# EAGLE design Lamp Logic Board_4 (EAGLE 9.4.2)

## Sheet 1 of 4
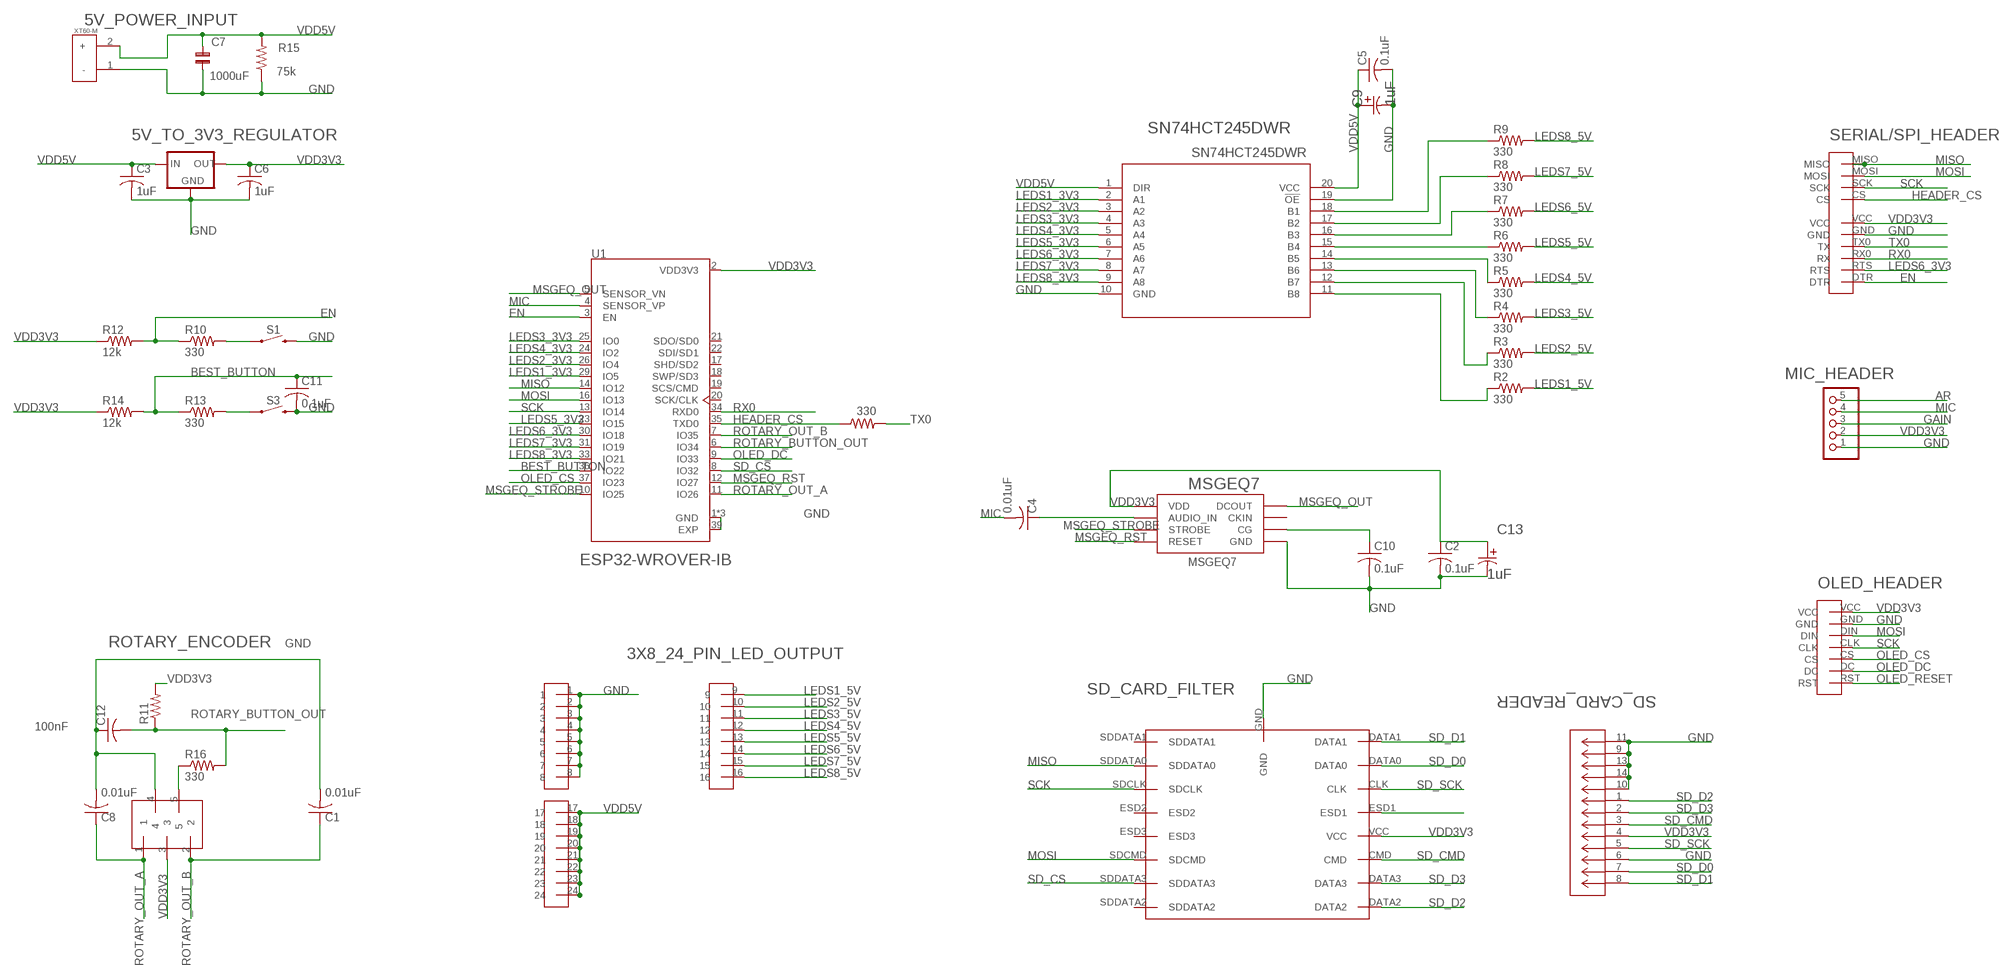
[diagram p0: schematic, sheet 1]

### Parts
3X8_24_PIN_LED_OUTPUT  3X8PINHEAD  [3X8PINHEAD]
5V_POWER_INPUT  XT60-M  [AMASS_XT60-M]
5V_TO_3V3_REGULATOR  LM1117MP-1.8  [SOT223]
C1  0.01uF  C-USC0402  [C0402]
C2  0.1uF  C-USC0805  [C0805]
C3  1uF  C-USC0402  [C0402]
C4  0.01uF  C-USC0402  [C0402]
C5  0.1uF  C-USC0805  [C0805]
C6  1uF  C-USC0402  [C0402]
C7  1000uF  C-BP-2,0X5  [ENP2,0-5]
C8  0.01uF  C-USC0402  [C0402]
C9  1uF  EEEFC1V1R0R  [CAP_EEFC_B]
C10  0.1uF  C-USC0805  [C0805]
C11  0.1uF  C-USC0805  [C0805]
C12  100nF  C-USC0402  [C0402]
C13  1uF  EEEFC1V1R0R  [CAP_EEFC_B]
MIC_HEADER  PINHD-1X5  [1X05]
MSGEQ7  MSGEQ7DIL  [DIL-08]
OLED_HEADER  SPIOLED_STANDOFF  [SPIOLED_STADOFF]
R1  330  R-US_R1206  [R1206]
R2  330  R-US_R1206  [R1206]
R3  330  R-US_R1206  [R1206]
R4  330  R-US_R1206  [R1206]
R5  330  R-US_R1206  [R1206]
R6  330  R-US_R1206  [R1206]
R7  330  R-US_R1206  [R1206]
R8  330  R-US_R1206  [R1206]
R9  330  R-US_R1206  [R1206]
R10  330  R-US_R1206  [R1206]
R11  R-US_R0603  [R0603]
R12  12k  R-US_R0603  [R0603]
R13  330  R-US_R1206  [R1206]
R14  12k  R-US_R0603  [R0603]
R15  75k  R-US_0309/12  [0309/12]
R16  330  R-US_R1206  [R1206]
ROTARY_ENCODER  EN11-HSM1AF15  [EN11-HSM]
S1  MOMENTARY-SWITCH-SPST-SMD-6.0X3.5MM  [TACTILE_SWITCH_SMD_6.0X3.5MM]
S3  MOMENTARY-SWITCH-SPST-SMD-12MM  [TACTILE_SWITCH_SMD_12MM]
SD_CARD_FILTER  CM1624-08DE  [CM1624-08DE]
SD_CARD_READER  LLC  [CON00218_8]
SERIAL/SPI_HEADER  2X6PINHEAD  [2X6PINHEAD]
SN74HCT245DWR  SN74HCT245DWR  [DW20]
U1  ESP32-WROVER-IB  ESP32-WROVER-I  [XCVR_ESP32-WROVER-I]

### Nets
AR: MIC_HEADER.5
BEST_BUTTON: C11.1 R13.1 R14.2 U1.36(IO22)
EN: R10.1 R12.2 SERIAL/SPI_HEADER.DTR U1.3(EN)
GAIN: MIC_HEADER.3
GND: 3X8_24_PIN_LED_OUTPUT.1 3X8_24_PIN_LED_OUTPUT.2 3X8_24_PIN_LED_OUTPUT.3 3X8_24_PIN_LED_OUTPUT.4 3X8_24_PIN_LED_OUTPUT.5 3X8_24_PIN_LED_OUTPUT.6 3X8_24_PIN_LED_OUTPUT.7 3X8_24_PIN_LED_OUTPUT.8 5V_POWER_INPUT.1(-) 5V_TO_3V3_REGULATOR.1(GND) C1.2 C2.2 C3.2 C5.2 C6.2 C7.1 C8.2 C9.2 C10.2 C11.2 C12.1 C13.2 MIC_HEADER.1 MSGEQ7.2(GND) OLED_HEADER.GND R15.1 ROTARY_ENCODER.4 S1.2 S3.3 SD_CARD_FILTER.GND SD_CARD_READER.6 SD_CARD_READER.9 SD_CARD_READER.10 SD_CARD_READER.11 SD_CARD_READER.13 SD_CARD_READER.14 SERIAL/SPI_HEADER.GND SN74HCT245DWR.10(GND) SN74HCT245DWR.19(!OE) U1.1(GND) U1.15(GND) U1.38(GND) U1.39(EXP)
HEADER_CS: R1.1 SERIAL/SPI_HEADER.CS U1.35(TXD0)
LEDS1_3V3: SN74HCT245DWR.2(A1) U1.29(IO5)
LEDS1_5V: 3X8_24_PIN_LED_OUTPUT.9 R2.2
LEDS2_3V3: SN74HCT245DWR.3(A2) U1.26(IO4)
LEDS2_5V: 3X8_24_PIN_LED_OUTPUT.10 R3.2
LEDS3_3V3: SN74HCT245DWR.4(A3) U1.25(IO0)
LEDS3_5V: 3X8_24_PIN_LED_OUTPUT.11 R4.2
LEDS4_3V3: SN74HCT245DWR.5(A4) U1.24(IO2)
LEDS4_5V: 3X8_24_PIN_LED_OUTPUT.12 R5.2
LEDS5_3V3: SN74HCT245DWR.6(A5) U1.23(IO15)
LEDS5_5V: 3X8_24_PIN_LED_OUTPUT.13 R6.2
LEDS6_3V3: SERIAL/SPI_HEADER.RTS SN74HCT245DWR.7(A6) U1.30(IO18)
LEDS6_5V: 3X8_24_PIN_LED_OUTPUT.14 R7.2
LEDS7_3V3: SN74HCT245DWR.8(A7) U1.31(IO19)
LEDS7_5V: 3X8_24_PIN_LED_OUTPUT.15 R8.2
LEDS8_3V3: SN74HCT245DWR.9(A8) U1.33(IO21)
LEDS8_5V: 3X8_24_PIN_LED_OUTPUT.16 R9.2
MIC: C4.2 MIC_HEADER.4 U1.4(SENSOR_VP)
MISO: SD_CARD_FILTER.SDDATA0 SERIAL/SPI_HEADER.MISO U1.14(IO12)
MOSI: OLED_HEADER.DIN SD_CARD_FILTER.SDCMD SERIAL/SPI_HEADER.MOSI U1.16(IO13)
MSGEQ_OUT: MSGEQ7.3(DCOUT) U1.5(SENSOR_VN)
MSGEQ_RST: MSGEQ7.7(RESET) U1.12(IO27)
MSGEQ_STROBE: MSGEQ7.4(STROBE) U1.10(IO25)
N$1: R9.1 SN74HCT245DWR.18(B1)
N$3: C4.1 MSGEQ7.5(AUDIO_IN)
N$4: C10.1 MSGEQ7.6(CG)
N$5: R16.1 ROTARY_ENCODER.5
N$6: R8.1 SN74HCT245DWR.17(B2)
N$7: R13.2 S3.1
N$8: SD_CARD_FILTER.ESD1
N$9: R10.2 S1.1
N$10: R7.1 SN74HCT245DWR.16(B3)
N$11: R6.1 SN74HCT245DWR.15(B4)
N$12: R5.1 SN74HCT245DWR.14(B5)
N$13: R4.1 SN74HCT245DWR.13(B6)
N$14: R3.1 SN74HCT245DWR.12(B7)
N$15: R2.1 SN74HCT245DWR.11(B8)
OLED_CS: OLED_HEADER.CS U1.37(IO23)
OLED_DC: OLED_HEADER.DC U1.9(IO33)
OLED_RESET: OLED_HEADER.RST
ROTARY_BUTTON_OUT: C12.2 R11.1 R16.2 U1.6(IO34)
ROTARY_OUT_A: C8.1 ROTARY_ENCODER.1 U1.11(IO26)
ROTARY_OUT_B: C1.1 ROTARY_ENCODER.2 U1.7(IO35)
RX0: SERIAL/SPI_HEADER.RX0(RX) U1.34(RXD0)
SCK: OLED_HEADER.CLK SD_CARD_FILTER.SDCLK SERIAL/SPI_HEADER.SCK U1.13(IO14)
SD_CMD: SD_CARD_FILTER.CMD SD_CARD_READER.3
SD_CS: SD_CARD_FILTER.SDDATA3 U1.8(IO32)
SD_D0: SD_CARD_FILTER.DATA0 SD_CARD_READER.7
SD_D1: SD_CARD_FILTER.DATA1 SD_CARD_READER.8
SD_D2: SD_CARD_FILTER.DATA2 SD_CARD_READER.1
SD_D3: SD_CARD_FILTER.DATA3 SD_CARD_READER.2
SD_SCK: SD_CARD_FILTER.CLK SD_CARD_READER.5
TX0: R1.2 SERIAL/SPI_HEADER.TX0(TX)
VDD3V3: 5V_TO_3V3_REGULATOR.2(OUT) 5V_TO_3V3_REGULATOR.4(OUT) C2.1 C6.1 C13.1 MIC_HEADER.2 MSGEQ7.1(VDD) OLED_HEADER.VCC R11.2 R12.1 R14.1 ROTARY_ENCODER.3 SD_CARD_FILTER.VCC SD_CARD_READER.4 SERIAL/SPI_HEADER.VCC U1.2(VDD3V3)
VDD5V: 3X8_24_PIN_LED_OUTPUT.17 3X8_24_PIN_LED_OUTPUT.18 3X8_24_PIN_LED_OUTPUT.19 3X8_24_PIN_LED_OUTPUT.20 3X8_24_PIN_LED_OUTPUT.21 3X8_24_PIN_LED_OUTPUT.22 3X8_24_PIN_LED_OUTPUT.23 3X8_24_PIN_LED_OUTPUT.24 5V_POWER_INPUT.2(+) 5V_TO_3V3_REGULATOR.3(IN) C3.1 C5.1 C7.2 C9.1 R15.2 SN74HCT245DWR.1(DIR) SN74HCT245DWR.20(VCC)
Unconnected: MSGEQ7.8(CKIN) SD_CARD_FILTER.ESD2 SD_CARD_FILTER.ESD3 SD_CARD_FILTER.SDDATA1 SD_CARD_FILTER.SDDATA2 U1.17(SHD/SD2) U1.18(SWP/SD3) U1.19(SCS/CMD) U1.20(SCK/CLK) U1.21(SDO/SD0) U1.22(SDI/SD1)

## Sheet 2 of 4

## Sheet 3 of 4

## Sheet 4 of 4

## Library data of the parts
3X8_24_PIN_LED_OUTPUT = 3X8PINHEAD:3X8PINHEAD
5V_POWER_INPUT = XT60-M:XT60-M: DC supply; XT60; male; PIN:2; for cable; soldered; 60A; 500V; AVAILABILITY: Unavailable; MF: AMASS; MP: XT60-M; PACKAGE: Package Analog Devices; PRICE: None
5V_TO_3V3_REGULATOR = lm1117:LM1117?-*: 800mA Low-Dropout Linear Regulator Source: http://ww1.microchip.com/downloads/en/DeviceDoc/39760d.pdf; MF: Texas Instruments; MPN: LM1117MP-1.8; OC_FARNELL: 1469053; OC_NEWARK: 41K3467
C1-C6 C8 C10-C12 = resistor:C-US: CAPACITOR, American symbol
C7 = cap-pan40:C-BP: BIPOLAR ELECTROLYTIC
C9 C13 = EEE-FC1V1R0R:EEEFC1V1R0R; MANUFACTURER_PART_NUMBER: EEEFC1V1R0R; VENDOR: Panasonic
MIC_HEADER = pinhead:PINHD-1X5: PIN HEADER
MSGEQ7 = MSGEQ7:MSGEQ7: 7-band graphic equalizer; DESCRIPTION: Seven Band Graphic Equalizer Display Filter; DIGI-KEY_PART_NUMBER: 1568-1544-ND; DIGI-KEY_PURCHASE_URL: https://www.digikey.com/product-detail/en/sparkfun-electronics/DEV-13116/1568-1544-ND/5764478?utm_source=snapeda&utm_medium=aggregator&utm_campaign=symbol; MF: SparkFun Electronics; MP: MSGEQ7; PACKAGE: SOIC-8 Mixed Signal Integration
OLED_HEADER = SPIOLED-STANDOFF:SPIOLED_STANDOFF
R1-R16 = resistor:R-US_: RESISTOR, American symbol
ROTARY_ENCODER = untitled:EN11-HSM1AF15
S1 = SparkFun-Switches:MOMENTARY-SWITCH-SPST: Momentary Switch (Pushbutton) - SPST Normally-open (NO) SPST momentary switches (buttons, pushbuttons). Variants PTH-12MM - 12mm square, through-hole Momentary Pushbutton Switch - 12mm Square <https://www.sparkfun.com/products/9190> (COM-09190) PTH-6.0MM, PTH-6.0MM-KIT - 6.0mm square, through-hole Mini Pushbutton Switch <https://www.sparkfun.com/products/97> (COM-00097) KIT package intended for soldering kit's - only one side of pads' copper is exposed. PTH-RIGHT-ANGLE-KIT - Right-angle, through-hole Right Angle Tactile Button <https://www.sparkfun.com/products/10791> - Used on SparkFun BigTime Watch Kit <https://www.sparkfun.com/products/11734> SMD-12MM - 12mm square, surface-mount Tactile Button - SMD (12mm) <https://www.sparkfun.com/products/12993> (COM-12993) Used on SparkFun PicoBoard <https://www.sparkfun.com/products/11888> SMD-4.5MM - 4.5mm Square Trackball Switch Used on SparkFun Blackberry Trackballer Breakout <https://www.sparkfun.com/products/13169> SMD-4.6MMX2.8MM - 4.60mm x 2.80mm, surface mount Used on SparkFun SAMD21 Mini Breakout <https://www.sparkfun.com/products/13664> SMD-5.2MM, SMD-5.2-REDUNDANT - 5.2mm square, surface-mount Mini Pushbutton Switch - SMD <https://www.sparkfun.com/products/8720> (COM-08720) Used on Arduino Pro Mini <https://www.sparkfun.com/products/11114> REDUNDANT package connects both switch circuits together SMD-6.0X3.5MM - 6.0 x 3.5mm, surface mount Momentary Reset Switch SMD <https://www.sparkfun.com/products/8229> (COM-08229) SMD-6.2MM-TALL - 6.2mm square, surface mount Tactile Button - SMD (6mm) <https://www.sparkfun.com/products/12992> Used on SparkFun Digital Sandbox <https://www.sparkfun.com/products/12651> SMD-RIGHT-ANGLE - Right-angle, surface mount Used on SparkFun Block for Intel® Edison - Arduino <https://www.sparkfun.com/products/13036>; PROD_ID: SWCH-00815; SF_SKU: COM-08229
S3 = SparkFun-Switches:MOMENTARY-SWITCH-SPST: Momentary Switch (Pushbutton) - SPST Normally-open (NO) SPST momentary switches (buttons, pushbuttons). Variants PTH-12MM - 12mm square, through-hole Momentary Pushbutton Switch - 12mm Square <https://www.sparkfun.com/products/9190> (COM-09190) PTH-6.0MM, PTH-6.0MM-KIT - 6.0mm square, through-hole Mini Pushbutton Switch <https://www.sparkfun.com/products/97> (COM-00097) KIT package intended for soldering kit's - only one side of pads' copper is exposed. PTH-RIGHT-ANGLE-KIT - Right-angle, through-hole Right Angle Tactile Button <https://www.sparkfun.com/products/10791> - Used on SparkFun BigTime Watch Kit <https://www.sparkfun.com/products/11734> SMD-12MM - 12mm square, surface-mount Tactile Button - SMD (12mm) <https://www.sparkfun.com/products/12993> (COM-12993) Used on SparkFun PicoBoard <https://www.sparkfun.com/products/11888> SMD-4.5MM - 4.5mm Square Trackball Switch Used on SparkFun Blackberry Trackballer Breakout <https://www.sparkfun.com/products/13169> SMD-4.6MMX2.8MM - 4.60mm x 2.80mm, surface mount Used on SparkFun SAMD21 Mini Breakout <https://www.sparkfun.com/products/13664> SMD-5.2MM, SMD-5.2-REDUNDANT - 5.2mm square, surface-mount Mini Pushbutton Switch - SMD <https://www.sparkfun.com/products/8720> (COM-08720) Used on Arduino Pro Mini <https://www.sparkfun.com/products/11114> REDUNDANT package connects both switch circuits together SMD-6.0X3.5MM - 6.0 x 3.5mm, surface mount Momentary Reset Switch SMD <https://www.sparkfun.com/products/8229> (COM-08229) SMD-6.2MM-TALL - 6.2mm square, surface mount Tactile Button - SMD (6mm) <https://www.sparkfun.com/products/12992> Used on SparkFun Digital Sandbox <https://www.sparkfun.com/products/12651> SMD-RIGHT-ANGLE - Right-angle, surface mount Used on SparkFun Block for Intel® Edison - Arduino <https://www.sparkfun.com/products/13036>; PROD_ID: SWCH-11967; SF_SKU: COM-12993
SD_CARD_FILTER = CM1624-08DE:CM1624-08DE
SD_CARD_READER = 5027740891:LLC; MANUFACTURER_PART_NUMBER: LLC; VENDOR: Molex Connector Corporation
SERIAL/SPI_HEADER = 2X4PINHEAD:2X6PINHEAD
SN74HCT245DWR = SN74HCT245DWR :SN74HCT245DWR; MANUFACTURER_PART_NUMBER: SN74HCT245DWR; VENDOR: Texas Instruments
U1 = ESP32-WROVER-I:ESP32-WROVER-I: Module: combo; GPIO, I2C x2, I2S x2, SDIO, SPI x3, UART x3; U.FL; AVAILABILITY: Unavailable; DESCRIPTION: Module: combo; GPIO, I2C x2, I2S x2, SDIO, SPI x3, UART x3; U.FL; MF: Espressif Systems; MP: ESP32-WROVER-I; PACKAGE: Module Espressif Systems; PRICE: None

## Board
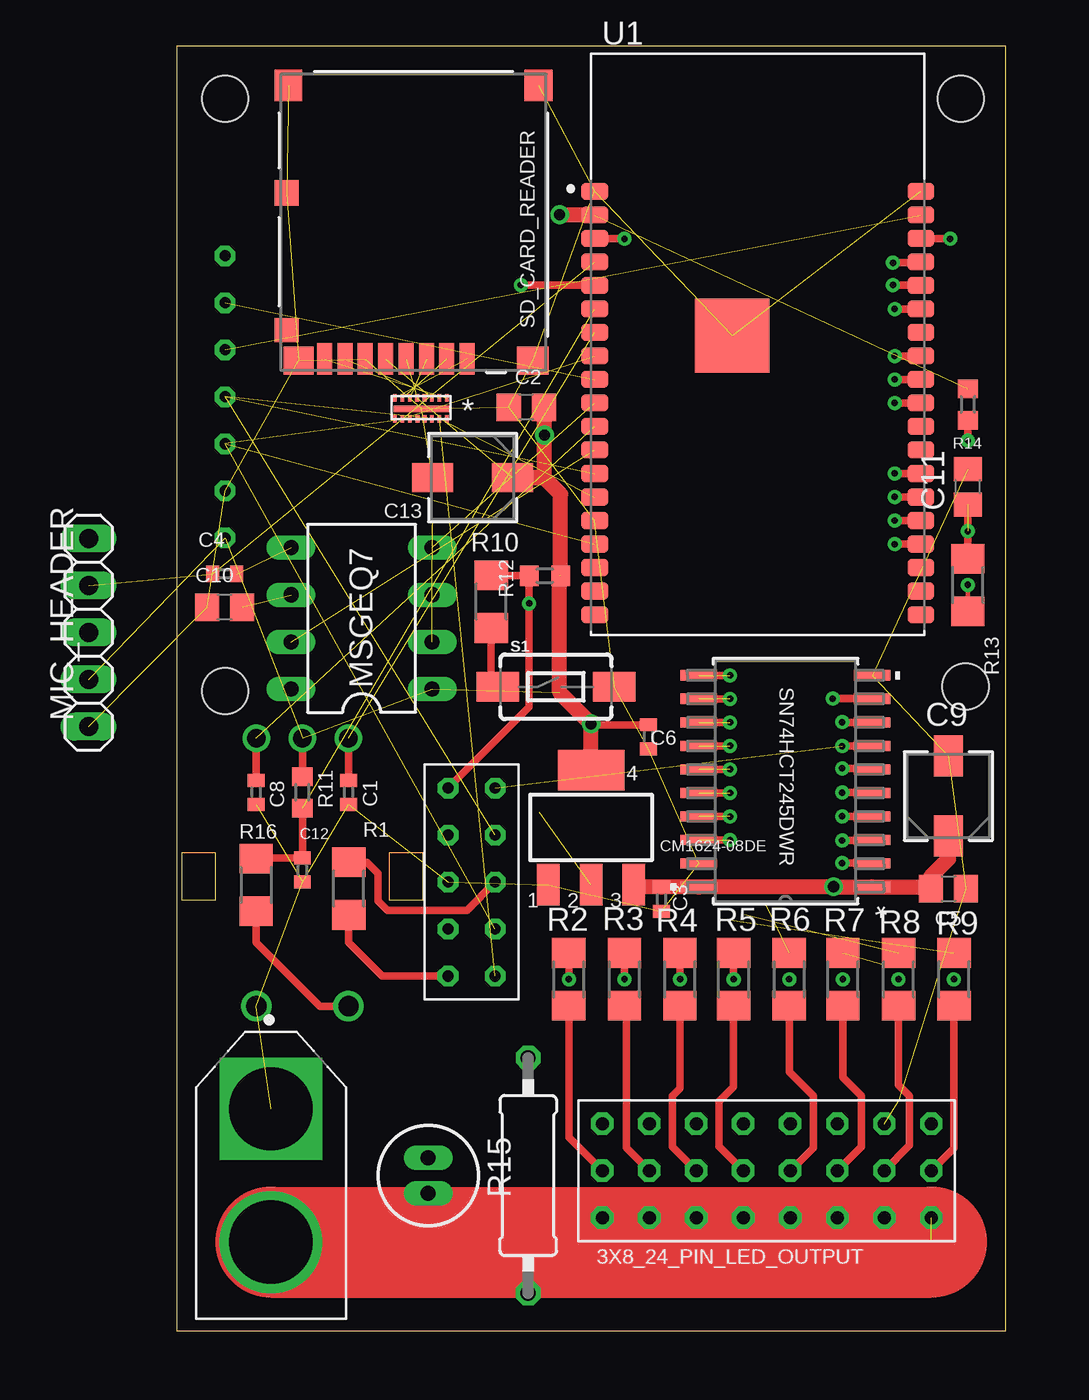
[diagram p1: board, top side]
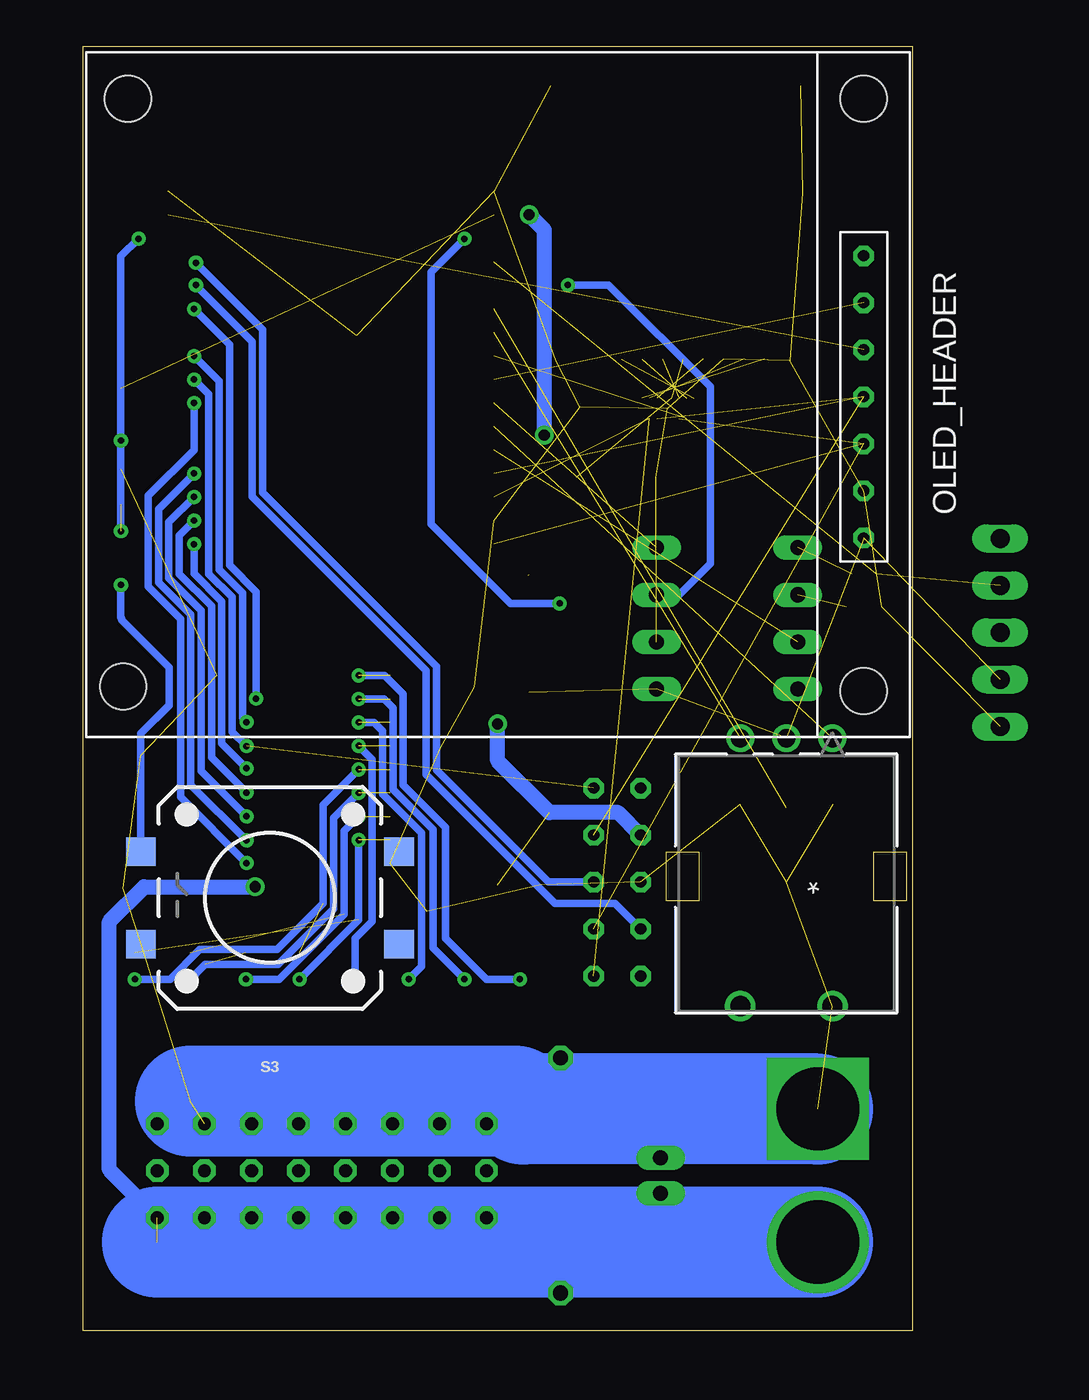
[diagram p2: board, bottom side, seen from below]

Size 44.8 x 69.4 mm. Coordinates in mm from the lower left corner, seen from the top.
Outline: 0,0 44.8,0 44.8,69.4 0,69.4 0,0
Copper layers (1*16): Top 0.035mm / dielectric 1.5mm / Bottom 0.035mm
Design rules "default": minimum track width 6mil, minimum drill 0.35mm, track to track 6mil, track to pad 6mil, pad to pad 6mil, via to via 6mil, smd to smd 6mil, copper to edge 40mil, drill to drill 6mil, minimum pad ring 10mil, minimum via ring 8mil, stop-mask expansion 4mil, vias tented up to drill 0mil, thermal gap 10mil

### Footprints (pad centres in the part's own frame; a part is rotated, then mirrored left to right if it is on the bottom)
3X8PINHEAD = drill 0.7 octagon: 1 0,0; 2 2.54,0; 3 5.08,0; 4 7.62,0; 5 10.16,0; 6 12.7,0; 7 15.24,0; 8 17.78,0; 9 0,-2.54; 10 2.54,-2.54; 11 5.08,-2.54; 12 7.62,-2.54; 13 10.16,-2.54; 14 12.7,-2.54; 15 15.24,-2.54; 16 17.78,-2.54; 17 0,-5.08; 18 2.54,-5.08; 19 5.08,-5.08; 20 7.62,-5.08; 21 10.16,-5.08; 22 12.7,-5.08; 23 15.24,-5.08; 24 17.78,-5.08
AMASS_XT60-M = drill 4.5 square: 1 -3.6,0 | drill 4.5: 2 3.6,0
SOT223 = smd 1.219 x 2.235: 1 -2.311,-3.099; 2 0,-3.099; 3 2.311,-3.099 | smd 3.6 x 2.2: 4 0,3.099
C0402 = smd 0.7 x 0.9: 1 -0.65,0; 2 0.65,0
C0805 = smd 1.3 x 1.5: 1 -0.95,0; 2 0.95,0
ENP2,0-5 = drill 0.813 pad 1.27 long: 1 -0.953,0; 2 0.953,0
CAP_EEFC_B = smd 2.21 x 1.575: 1 -2.159,0; 2 2.159,0
1X05 = drill 1.016 long: 1 -5.08,0; 2 -2.54,0; 3 0,0; 4 2.54,0; 5 5.08,0
DIL-08 = drill 0.813 long: 1 -3.81,-3.81; 2 -1.27,-3.81; 3 1.27,-3.81; 4 3.81,-3.81; 5 3.81,3.81; 6 1.27,3.81; 7 -1.27,3.81; 8 -3.81,3.81
SPIOLED_STADOFF = drill 0.6 octagon: CLK 18.39,2.5; CS 20.93,2.5; DC 23.47,2.5; DIN 15.85,2.5; GND 13.31,2.5; RST 26.01,2.5; VCC 10.77,2.5 | hole 2.5: 2.5,2.5; 34.5,2.5; 34.5,42.25; 2.75,42.5
R1206 = smd 1.6 x 1.803: 1 -1.422,0; 2 1.422,0
R0603 = smd 1 x 1.1: 1 -0.85,0; 2 0.85,0
0309/12 = drill 0.813 octagon: 1 -6.35,0; 2 6.35,0
EN11-HSM = drill 0.991 pad 1.499: 1 -2.489,7.874; 2 2.489,7.874; 3 0,7.874 | drill 1.092 pad 1.6: 4 -2.489,22.352; 5 2.489,22.352
TACTILE_SWITCH_SMD_6.0X3.5MM = smd 2.3 x 1.6: 1 -3.15,0; 2 3.15,0
TACTILE_SWITCH_SMD_12MM = smd 1.6 x 1.55: 1 6.975,-2.5; 2 -6.975,-2.5; 3 6.975,2.5; 4 -6.975,2.5
CM1624-08DE = smd 0.2 x 0.4: CLK 1,0; CMD 2.2,0; DATA0 0.6,0; DATA1 0.2,0; DATA2 3,0; DATA3 2.6,0; ESD1 1.4,0; ESD2 1.4,1.125; ESD3 1.775,1.125; SDCLK 1,1.125; SDCMD 2.2,1.125; SDDATA0 0.6,1.125; SDDATA1 0.2,1.125; SDDATA2 3,1.125; SDDATA3 2.6,1.125; VCC 1.8,0 | smd 3 x 0.35: GND 1.575,0.575
CON00218_8 = smd 0.813 x 1.676: 1 2.899,-7.387; 2 1.799,-7.387; 3 0.699,-7.387; 4 -0.401,-7.387; 5 -1.501,-7.387; 6 -2.601,-7.387; 7 -3.701,-7.387; 8 -4.801,-7.387 | smd 1.499 x 1.702: 9 -6.751,7.374; 10 6.751,7.374 | smd 1.295 x 1.397: 11 -6.859,1.577 | smd 1.295 x 1.295: 12 -6.859,-5.823 | smd 1.6 x 1.499: 13 -6.201,-7.476 | smd 1.702 x 1.499: 14 6.449,-7.476
2X6PINHEAD = drill 0.6 octagon: CS 6.35,3.81; DTR 1.27,1.27; GND 6.35,1.27; MISO 11.43,3.81; MOSI 8.89,3.81; RTS 1.27,3.81; RX0 8.89,1.27; SCK 3.81,3.81; TX0 11.43,1.27; VCC 3.81,1.27
DW20 = smd 1.981 x 0.559: 1 -4.686,5.715; 2 -4.686,4.445; 3 -4.686,3.175; 4 -4.686,1.905; 5 -4.686,0.635; 6 -4.686,-0.635; 7 -4.686,-1.905; 8 -4.686,-3.175; 9 -4.686,-4.445; 10 -4.686,-5.715; 11 4.686,-5.715; 12 4.686,-4.445; 13 4.686,-3.175; 14 4.686,-1.905; 15 4.686,-0.635; 16 4.686,0.635; 17 4.686,1.905; 18 4.686,3.175; 19 4.686,4.445; 20 4.686,5.715
XCVR_ESP32-WROVER-I = smd 1.45 x 0.93: 1 -8.81,8.26; 2 -8.81,6.99; 3 -8.81,5.72; 4 -8.81,4.45; 5 -8.81,3.18; 6 -8.81,1.91; 7 -8.81,0.64; 8 -8.81,-0.63; 9 -8.81,-1.9; 10 -8.81,-3.17; 11 -8.81,-4.44; 12 -8.81,-5.71; 13 -8.81,-6.98; 14 -8.81,-8.25; 15 -8.81,-9.52; 16 -8.81,-10.79; 17 -8.81,-12.06; 18 -8.81,-13.33; 19 -8.81,-14.6; 20 8.81,-14.6; 21 8.81,-13.33; 22 8.81,-12.06; 23 8.81,-10.79; 24 8.81,-9.52; 25 8.81,-8.25; 26 8.81,-6.98; 27 8.81,-5.71; 28 8.81,-4.44; 29 8.81,-3.17; 30 8.81,-1.9; 31 8.81,-0.63; 32 8.81,0.64; 33 8.81,1.91; 34 8.81,3.18; 35 8.81,4.45; 36 8.81,5.72; 37 8.81,6.99; 38 8.81,8.26 | smd 4 x 4: 39 -1.38,0.47

### Placement (x,y rotation side)
3X8_24_PIN_LED_OUTPUT  23,11.2 0 top
5V_POWER_INPUT  5.1,8.4 270 top
5V_TO_3V3_REGULATOR  22.4,27.2 0 top
C1  9.3,29.1 270 top
C2  18.9,49.9 180 top
C3  26.2,23.33 270 top
C4  2.6,40.9 180 top
C5  41.7,23.9 0 top
C6  25.5,32.1 270 top
C7  13.6,8.4 270 top
C8  4.3,29.1 270 top
C9  41.7,28.9 90 top
C10  2.6,39.1 180 top
C11  42.75,45.6 90 top
C12  6.8,24.9 90 top
C13  16,46.1 180 top
MIC_HEADER  -4.75,37.73 90 top  (outside the outline)
MSGEQ7  10,38.5 90 top
OLED_HEADER  0.12,32.08 90 bottom
R1  9.3,23.9 270 top
R2  21.2,19 270 top
R3  24.2,19 270 top
R4  27.2,19 270 top
R5  30.1,19 270 top
R6  33.1,19 270 top
R7  36,19 270 top
R8  39,19 270 top
R9  42,19 270 top
R10  17,39.4 270 top
R11  6.8,29.1 90 top
R12  19.9,40.8 180 top
R13  42.75,40.3 270 top
R14  42.75,50.05 270 top
R15  19,8.4 270 top
R16  4.3,24.1 90 top
ROTARY_ENCODER  6.8,39.9 180 bottom
S1  20.5,34.8 0 top
S3  34.7,23.4 180 bottom
SD_CARD_FILTER  14.8,50.4 180 top
SD_CARD_READER  12.8,59.9 0 top
SERIAL/SPI_HEADER  13.4,30.6 270 top
SN74HCT245DWR  32.9,29.7 180 top
U1  31.4,53.3 0 top

### Tracks (layer width: path | path; a pad name or v marks a point on that pad's centre or on a via)
BEST_BUTTON  (via drill 0.35)  (1 unrouted)
  Top 0.406: v42.75,48.1 R14.2 | C11.1 R13.1 | v41.8,59 40.23,59 U1.36
  Bottom 0.406: v42.75,43.2 v42.75,48.1 42.75,58.05 v41.8,59
EN  (via drill 0.35)
  Top 0.406: R10.1 17.02,40.8 R12.2 v19.05,39.3 19.05,33.71 SERIAL/SPI_HEADER.DTR | v24.2,59 22.61,59 U1.3
  Bottom 0.406: v19.05,39.3 21.7,39.3 26,43.6 26,57.2 v24.2,59
GND  (33 unrouted)
  Bottom 0.813: C7.1 R15.1 22.55,11.2 3X8_24_PIN_LED_OUTPUT.1 3X8_24_PIN_LED_OUTPUT.2 3X8_24_PIN_LED_OUTPUT.3 3X8_24_PIN_LED_OUTPUT.4 3X8_24_PIN_LED_OUTPUT.5 3X8_24_PIN_LED_OUTPUT.6 3X8_24_PIN_LED_OUTPUT.7 3X8_24_PIN_LED_OUTPUT.8
  Bottom 6: 5V_POWER_INPUT.1 21.03,12 21.44,12.42 39,12.42
HEADER_CS  (via drill 0.35)
  Top 0.406: U1.35 40.26,57.7 v38.7,57.7 | R1.1 10.3,25.32 10.9,24.72 10.9,23.22 11.4,22.72 15.68,22.72 SERIAL/SPI_HEADER.CS
  Bottom 0.406: v38.7,57.7 35.1,54.1 35.1,45.3 25.7,35.9 25.7,30.3 19.65,24.25 SERIAL/SPI_HEADER.CS
LEDS1_3V3  (via drill 0.35)
  Top 0.406: U1.29 v38.8,50.13 | v35.97,25.27 37.57,25.27 SN74HCT245DWR.2
  Bottom 0.406: v38.8,50.13 38.8,47.6 41.28,45.12 41.28,40.21 39.53,38.46 39.53,28.84 v35.97,25.27
LEDS1_5V
  Top 0.406: R2.2 21.2,10.46 3X8_24_PIN_LED_OUTPUT.9
LEDS2_3V3  (via drill 0.35)
  Top 0.406: U1.26 v38.8,46.32 | v35.97,26.5 37.56,26.5 SN74HCT245DWR.3
  Bottom 0.406: v38.8,46.32 40.72,44.4 40.72,40.44 38.98,38.7 38.98,29.51 v35.97,26.5
LEDS2_5V
  Top 0.406: R3.2 24.3,17.48 24.3,9.9 3X8_24_PIN_LED_OUTPUT.10
LEDS3_3V3  (via drill 0.35)
  Top 0.406: U1.25 v38.8,45.05 | v35.97,27.8 SN74HCT245DWR.4
  Bottom 0.406: v38.8,45.05 40.16,43.69 40.16,40.67 38.42,38.93 38.42,30.25 v35.97,27.8
LEDS3_5V
  Top 0.406: R4.2 27.2,13.1 26.8,12.7 26.8,9.94 3X8_24_PIN_LED_OUTPUT.11
LEDS4_3V3  (via drill 0.35)
  Top 0.406: U1.24 v38.8,43.78 | v35.97,29.08 37.57,29.08 SN74HCT245DWR.5
  Bottom 0.406: v38.8,43.78 39.6,42.98 39.6,40.9 37.86,39.16 37.86,30.97 v35.97,29.08
LEDS4_5V
  Top 0.406: R5.2 30.1,13.2 29.3,12.4 29.3,9.98 3X8_24_PIN_LED_OUTPUT.12
LEDS5_3V3  (via drill 0.35)
  Top 0.406: U1.23 v38.8,42.51 | v35.97,30.4 37.52,30.4 SN74HCT245DWR.6
  Bottom 0.406: v38.8,42.51 38.8,40.91 37.3,39.41 37.3,31.73 v35.97,30.4
LEDS5_5V
  Top 0.406: R6.2 33.1,14 34.4,12.7 34.4,9.9 3X8_24_PIN_LED_OUTPUT.13
LEDS6_3V3  (via drill 0.35)  (1 unrouted)
  Top 0.406: U1.30 v38.8,51.4 | v35.97,31.6 SN74HCT245DWR.7
  Bottom 0.406: v38.8,51.4 38,50.6 38,40.9 36.74,39.64 36.74,32.37 v35.97,31.6
LEDS6_5V
  Top 0.406: R7.2 36,13.7 37,12.7 37,9.96 3X8_24_PIN_LED_OUTPUT.14
LEDS7_3V3  (via drill 0.35)
  Top 0.406: U1.31 v38.8,52.67 | v35.97,32.89 35.99,32.88 SN74HCT245DWR.8
  Bottom 0.406: v38.8,52.67 37.44,51.31 37.44,41.13 36.18,39.87 36.18,33.1 v35.97,32.89
LEDS7_5V
  Top 0.406: R8.2 39,13.3 39.6,12.7 39.6,10.02 3X8_24_PIN_LED_OUTPUT.15
LEDS8_3V3  (via drill 0.35)
  Top 0.406: U1.33 v38.8,55.21 | v35.45,34.16 37.57,34.16 SN74HCT245DWR.9
  Bottom 0.406: v38.8,55.21 36.88,53.29 36.88,41.36 35.45,39.93 v35.45,34.16
LEDS8_5V
  Top 0.406: R9.2 42,9.88 3X8_24_PIN_LED_OUTPUT.16
MIC  (2 unrouted)
MISO  (2 unrouted)
MOSI  (3 unrouted)
MSGEQ_OUT  (via drill 0.35)
  Top 0.406: U1.5 22.57,56.5 v18.6,56.5
  Bottom 0.406: MSGEQ7.3 12.61,39.77 10.91,41.47 10.91,51.01 16.4,56.5 v18.6,56.5
MSGEQ_RST  (1 unrouted)
MSGEQ_STROBE  (1 unrouted)
N$1  (via drill 0.35)  (2 unrouted)
  Top 0.406: SN74HCT245DWR.18 v29.91,26.52
  Bottom 0.406: v29.91,26.52 29.91,22.2 v33.1,19
N$3  (1 unrouted)
N$4  (1 unrouted)
N$5
  Top 0.406: R16.1 4.3,21 7.75,17.55 ROTARY_ENCODER.5
N$6  (via drill 0.35)  (2 unrouted)
  Top 0.406: SN74HCT245DWR.17 v29.91,27.8
  Bottom 0.406: v29.91,27.8 30.7,27 30.7,22.5 34.2,19 v36,19
N$7  (via drill 0.35)
  Top 0.254: R13.2 v42.75,40.3
  Bottom 0.254: 42.71,38.49 40.13,35.92 40.13,33.93 41.67,32.39 S3.1
  Bottom 0.406: v42.75,40.3 42.75,38.53 42.71,38.49 42.71,38.4 40.16,35.85 40.16,33.8 41.67,32.28 S3.1
N$9
  Top 0.406: R10.2 17,35.15 S1.1
N$10  (via drill 0.35)  (2 unrouted)
  Top 0.406: SN74HCT245DWR.16 v29.91,29.07
  Bottom 0.406: v29.91,29.07 31.26,27.71 31.26,22.8 34.26,19.8 38.2,19.8 v39,19
N$11  (via drill 0.35)  (2 unrouted)
  Top 0.406: SN74HCT245DWR.15 v29.91,30.34
  Bottom 0.406: v29.91,30.34 31.82,28.42 31.82,23.1 34.32,20.6 38.5,20.6 40.1,19 v42,19
N$12  (via drill 0.35)  (1 unrouted)
  Top 0.406: SN74HCT245DWR.14 v29.91,31.61 | v30.1,19 30.1,20.4 30.09,20.41 R5.1
  Bottom 0.406: v29.91,31.61 29.18,30.88 29.18,22.12 30.1,21.2 v30.1,19
N$13  (via drill 0.35)  (1 unrouted)
  Top 0.406: SN74HCT245DWR.13 v29.91,32.88 | v27.2,19 R4.1
  Bottom 0.406: v29.91,32.88 29.07,32.88 28.62,32.42 28.62,29.02 26.5,26.9 26.5,19.7 v27.2,19
N$14  (via drill 0.35)  (1 unrouted)
  Top 0.406: SN74HCT245DWR.12 v29.91,34.15 | v24.2,19 R3.1
  Bottom 0.406: v29.91,34.15 28.55,34.15 28.06,33.66 28.06,29.26 25.9,27.1 25.9,20.7 v24.2,19
N$15  (via drill 0.35)  (1 unrouted)
  Top 0.406: SN74HCT245DWR.11 v29.91,35.41 | v21.2,19 R2.1
  Bottom 0.406: v29.91,35.41 28.52,35.41 27.5,34.4 27.5,29.5 25.2,27.2 25.2,21.2 23,19 v21.2,19
OLED_CS  (1 unrouted)
OLED_DC  (1 unrouted)
ROTARY_BUTTON_OUT  (1 unrouted)
  Top 0.406: R11.1 C12.2 4.33,25.55 R16.2
ROTARY_OUT_A  (1 unrouted)
  Top 0.406: C8.1 4.3,32.02 ROTARY_ENCODER.1
ROTARY_OUT_B  (1 unrouted)
  Top 0.406: C1.1 9.3,32.02 ROTARY_ENCODER.2
RX0  (via drill 0.35)
  Top 0.406: v38.7,56.5 40.19,56.5 U1.34
  Bottom 0.406: SERIAL/SPI_HEADER.RX0 16.06,23.1 19.29,23.1 26.26,30.07 26.26,35.67 35.66,45.07 35.66,53.46 v38.7,56.5
SCK  (3 unrouted)
SD_CMD  (1 unrouted)
SD_CS  (1 unrouted)
SD_D0  (1 unrouted)
SD_D1  (1 unrouted)
SD_D2  (1 unrouted)
SD_D3  (1 unrouted)
SD_SCK  (1 unrouted)
TX0
  Top 0.406: R1.2 9.3,20.98 11.11,19.17 SERIAL/SPI_HEADER.TX0
VDD3V3  (via drill 0.6)  (9 unrouted)
  Top 0.406: C6.1 22.45,32.75 v22.4,32.8 | R11.2 ROTARY_ENCODER.3
  Top 0.813: C2.1 19.88,49.87 v19.88,48.4 19.88,46.1 C13.1 19.86,46.1 20.75,45.21 R12.1 | 5V_TO_3V3_REGULATOR.4 v22.4,32.8 20.7,34.5 20.7,40.85 | v20.7,60.3 U1.2
  Bottom 0.813: SERIAL/SPI_HEADER.VCC 15.88,28 19.6,28 22.4,30.8 v22.4,32.8 | v19.88,48.4 19.88,59.48 v20.7,60.3
VDD5V  (via drill 0.6)  (1 unrouted)
  Top 0.813: C9.1 41.7,25.5 40.75,24.55 C5.1 40.66,23.98 SN74HCT245DWR.1 37.57,24 v35.5,24 28.23,24 SN74HCT245DWR.20 C3.1 24.84,23.98 5V_TO_3V3_REGULATOR.3 | 3X8_24_PIN_LED_OUTPUT.17 25.5,6.12 3X8_24_PIN_LED_OUTPUT.19 | 3X8_24_PIN_LED_OUTPUT.19 3X8_24_PIN_LED_OUTPUT.21 | 3X8_24_PIN_LED_OUTPUT.21 3X8_24_PIN_LED_OUTPUT.23 3X8_24_PIN_LED_OUTPUT.24 | 3X8_24_PIN_LED_OUTPUT.22 3X8_24_PIN_LED_OUTPUT.21 | 3X8_24_PIN_LED_OUTPUT.20 3X8_24_PIN_LED_OUTPUT.19
  Top 6: 5V_POWER_INPUT.2 40.78,4.8
  Bottom 0.813: v35.5,24 41.5,24 43.38,22.12 43.38,8.71 3X8_24_PIN_LED_OUTPUT.24 3X8_24_PIN_LED_OUTPUT.23 3X8_24_PIN_LED_OUTPUT.22 3X8_24_PIN_LED_OUTPUT.21 3X8_24_PIN_LED_OUTPUT.20 3X8_24_PIN_LED_OUTPUT.19 3X8_24_PIN_LED_OUTPUT.18 3X8_24_PIN_LED_OUTPUT.17 23,6.05 R15.2 C7.2
  Bottom 6: 5V_POWER_INPUT.2 40.78,4.8

### Text on the board
tNames: CM1624-08DE